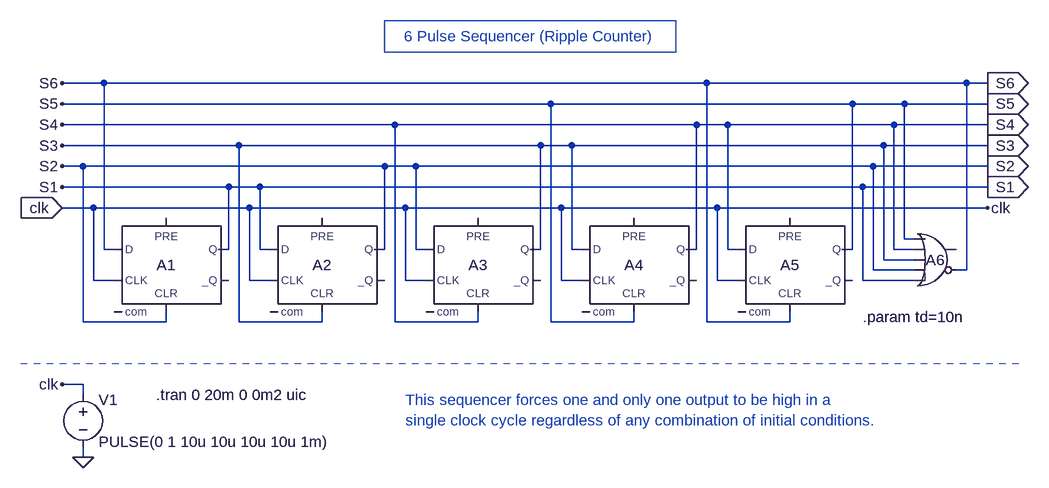
[diagram p0: schematic Sequencer6.asc]
Sequencer6.asc, the LTspice schematic file:
Version 4
SHEET 1 1196 680
WIRE -256 -320 -320 -320
WIRE 672 -320 -256 -320
WIRE 1072 -320 672 -320
WIRE 1104 -320 1072 -320
WIRE 432 -288 -320 -288
WIRE 896 -288 432 -288
WIRE 976 -288 896 -288
WIRE 1104 -288 976 -288
WIRE 192 -256 -320 -256
WIRE 656 -256 192 -256
WIRE 704 -256 656 -256
WIRE 960 -256 704 -256
WIRE 1104 -256 960 -256
WIRE -48 -224 -320 -224
WIRE 416 -224 -48 -224
WIRE 464 -224 416 -224
WIRE 944 -224 464 -224
WIRE 1104 -224 944 -224
WIRE -288 -192 -320 -192
WIRE 176 -192 -288 -192
WIRE 224 -192 176 -192
WIRE 928 -192 224 -192
WIRE 1104 -192 928 -192
WIRE -64 -160 -320 -160
WIRE -16 -160 -64 -160
WIRE 912 -160 -16 -160
WIRE 1104 -160 912 -160
WIRE -272 -128 -320 -128
WIRE -32 -128 -272 -128
WIRE 208 -128 -32 -128
WIRE 448 -128 208 -128
WIRE 688 -128 448 -128
WIRE 1104 -128 688 -128
WIRE 976 -80 976 -288
WIRE 992 -80 976 -80
WIRE -256 -64 -256 -320
WIRE -240 -64 -256 -64
WIRE -64 -64 -64 -160
WIRE -64 -64 -80 -64
WIRE -16 -64 -16 -160
WIRE 0 -64 -16 -64
WIRE 176 -64 176 -192
WIRE 176 -64 160 -64
WIRE 224 -64 224 -192
WIRE 240 -64 224 -64
WIRE 416 -64 416 -224
WIRE 416 -64 400 -64
WIRE 464 -64 464 -224
WIRE 480 -64 464 -64
WIRE 656 -64 656 -256
WIRE 656 -64 640 -64
WIRE 704 -64 704 -256
WIRE 720 -64 704 -64
WIRE 896 -64 896 -288
WIRE 896 -64 880 -64
WIRE 960 -64 960 -256
WIRE 992 -64 960 -64
WIRE 944 -48 944 -224
WIRE 992 -48 944 -48
WIRE 928 -32 928 -192
WIRE 992 -32 928 -32
WIRE 1072 -32 1072 -320
WIRE 1072 -32 1056 -32
WIRE -272 -16 -272 -128
WIRE -240 -16 -272 -16
WIRE -32 -16 -32 -128
WIRE 0 -16 -32 -16
WIRE 208 -16 208 -128
WIRE 240 -16 208 -16
WIRE 448 -16 448 -128
WIRE 480 -16 448 -16
WIRE 688 -16 688 -128
WIRE 720 -16 688 -16
WIRE 912 -16 912 -160
WIRE 992 -16 912 -16
WIRE -288 48 -288 -192
WIRE -160 48 -160 32
WIRE -160 48 -288 48
WIRE -48 48 -48 -224
WIRE 80 48 80 32
WIRE 80 48 -48 48
WIRE 192 48 192 -256
WIRE 320 48 320 32
WIRE 320 48 192 48
WIRE 432 48 432 -288
WIRE 560 48 560 32
WIRE 560 48 432 48
WIRE 672 48 672 -320
WIRE 800 48 800 32
WIRE 800 48 672 48
WIRE -288 144 -320 144
WIRE -288 160 -288 144
WIRE -288 256 -288 240
FLAG 1104 -160 S1
IOPIN 1104 -160 Out
FLAG 1104 -192 S2
IOPIN 1104 -192 Out
FLAG 1104 -224 S3
IOPIN 1104 -224 Out
FLAG 1104 -256 S4
IOPIN 1104 -256 Out
FLAG -320 -160 S1
FLAG -320 -192 S2
FLAG -320 -224 S3
FLAG -320 -256 S4
FLAG -288 256 0
FLAG -320 -128 clk
IOPIN -320 -128 In
FLAG 1104 -128 clk
FLAG -320 144 clk
FLAG 1104 -288 S5
IOPIN 1104 -288 Out
FLAG -320 -288 S5
FLAG 1104 -320 S6
IOPIN 1104 -320 Out
FLAG -320 -320 S6
SYMBOL Digital\\dflop -160 -112 R0
WINDOW 0 0 72 Center 0
WINDOW 3 -3 90 Left 0
SYMATTR InstName A1
SYMATTR SpiceLine td={td} tripdt={td/3}
SYMBOL Digital\\dflop 80 -112 R0
WINDOW 0 0 72 Center 0
WINDOW 3 -5 84 Left 0
SYMATTR InstName A2
SYMATTR SpiceLine td={td} tripdt={td/3}
SYMBOL Digital\\dflop 320 -112 R0
WINDOW 0 0 72 Center 0
WINDOW 3 -7 87 Left 0
SYMATTR InstName A3
SYMATTR SpiceLine td={td} tripdt={td/3}
SYMBOL voltage -288 144 R0
WINDOW 123 0 0 Left 0
WINDOW 39 0 0 Left 0
WINDOW 0 24 24 Left 0
WINDOW 3 24 88 Left 0
SYMATTR InstName V1
SYMATTR Value PULSE(0 1 10u 10u 10u 10u 1m)
SYMBOL Digital\\dflop 560 -112 R0
WINDOW 0 0 72 Center 0
WINDOW 3 -7 87 Left 0
SYMATTR InstName A4
SYMATTR SpiceLine td={td} tripdt={td/3}
SYMBOL Digital\\dflop 800 -112 R0
WINDOW 0 0 72 Center 0
WINDOW 3 -7 87 Left 0
SYMATTR InstName A5
SYMATTR SpiceLine td={td} tripdt={td/3}
SYMBOL Digital\\or 1024 -112 R0
WINDOW 0 0 64 Center 0
SYMATTR InstName A6
SYMATTR SpiceLine td={td} tripdt={td/3}
TEXT -176 160 Left 0 !.tran 0 20m 0 0m2 uic
TEXT 912 40 Left 0 !.param td=10n
TEXT 400 -392 Center 0 ;6 Pulse Sequencer (Ripple Counter)
TEXT 208 168 Left 0 ;This sequencer forces one and only one output to be high in a \nsingle clock cycle regardless of any combination of initial conditions.
LINE Normal 1152 112 -384 112 1
RECTANGLE Normal 624 -368 176 -416

The netlist it stands for:
* Sequencer6.asc
A1 S6 0 clk 0 S2 0 S1 0 DFLOP td={td} tripdt={td/3}
A2 S1 0 clk 0 S3 0 S2 0 DFLOP td={td} tripdt={td/3}
A3 S2 0 clk 0 S4 0 S3 0 DFLOP td={td} tripdt={td/3}
V1 clk 0 PULSE(0 1 10u 10u 10u 10u 1m)
A4 S3 0 clk 0 S5 0 S4 0 DFLOP td={td} tripdt={td/3}
A5 S4 0 clk 0 S6 0 S5 0 DFLOP td={td} tripdt={td/3}
A6 S5 S4 S3 S2 S1 S6 0 0 OR td={td} tripdt={td/3}
.tran 0 20m 0 0m2 uic
.param td=10n
* 6 Pulse Sequencer (Ripple Counter)
* This sequencer forces one and only one output to be high in a
* single clock cycle regardless of any combination of initial conditions.
.backanno
.end